# EAGLE design power_supply_stripped_th (EAGLE 7.1.0)
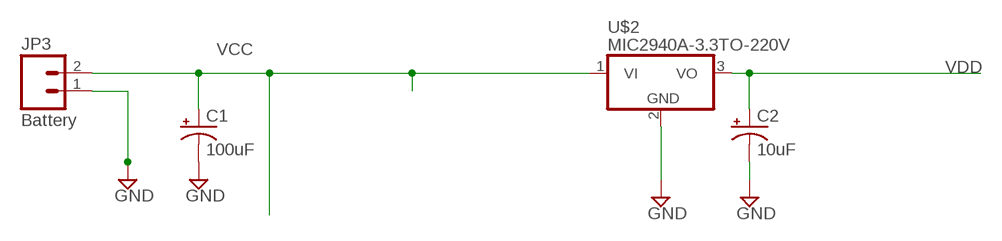
[diagram p0: schematic, sheet 1]

## Parts
C1  100uF  CPOL-USE3.5-8  [E3,5-8]
C2  10uF  CPOL-USE2.5-5  [E2,5-5]
JP3  Battery  M02PTH  [1X02]
U$2  MIC2940A-3.3TO-220V  [TO-220V]

## Nets
GND: C1.- C2.- JP3.1 U$2.2(GND)
VCC: C1.+ JP3.2 U$2.1(VI)
VDD: C2.+ U$2.3(VO)

## Library data of the parts
C1 C2 = rcl:CPOL-US: POLARIZED CAPACITOR, American symbol
JP3 = SparkFun:M02: Header 2 Standard 2-pin 0.1" header. Use with straight break away headers (SKU : PRT-00116), right angle break away headers (PRT-00553), swiss pins (PRT-00743), machine pins (PRT-00117), and female headers (PRT-00115). Molex polarized connector foot print use with SKU : PRT-08233 with associated crimp pins and housings.
U$2 = SparkFun:MIC2940A-3.3: MIC2940A-3.3 Voltage Regulator 3.3V mic2940.pdf

## Board
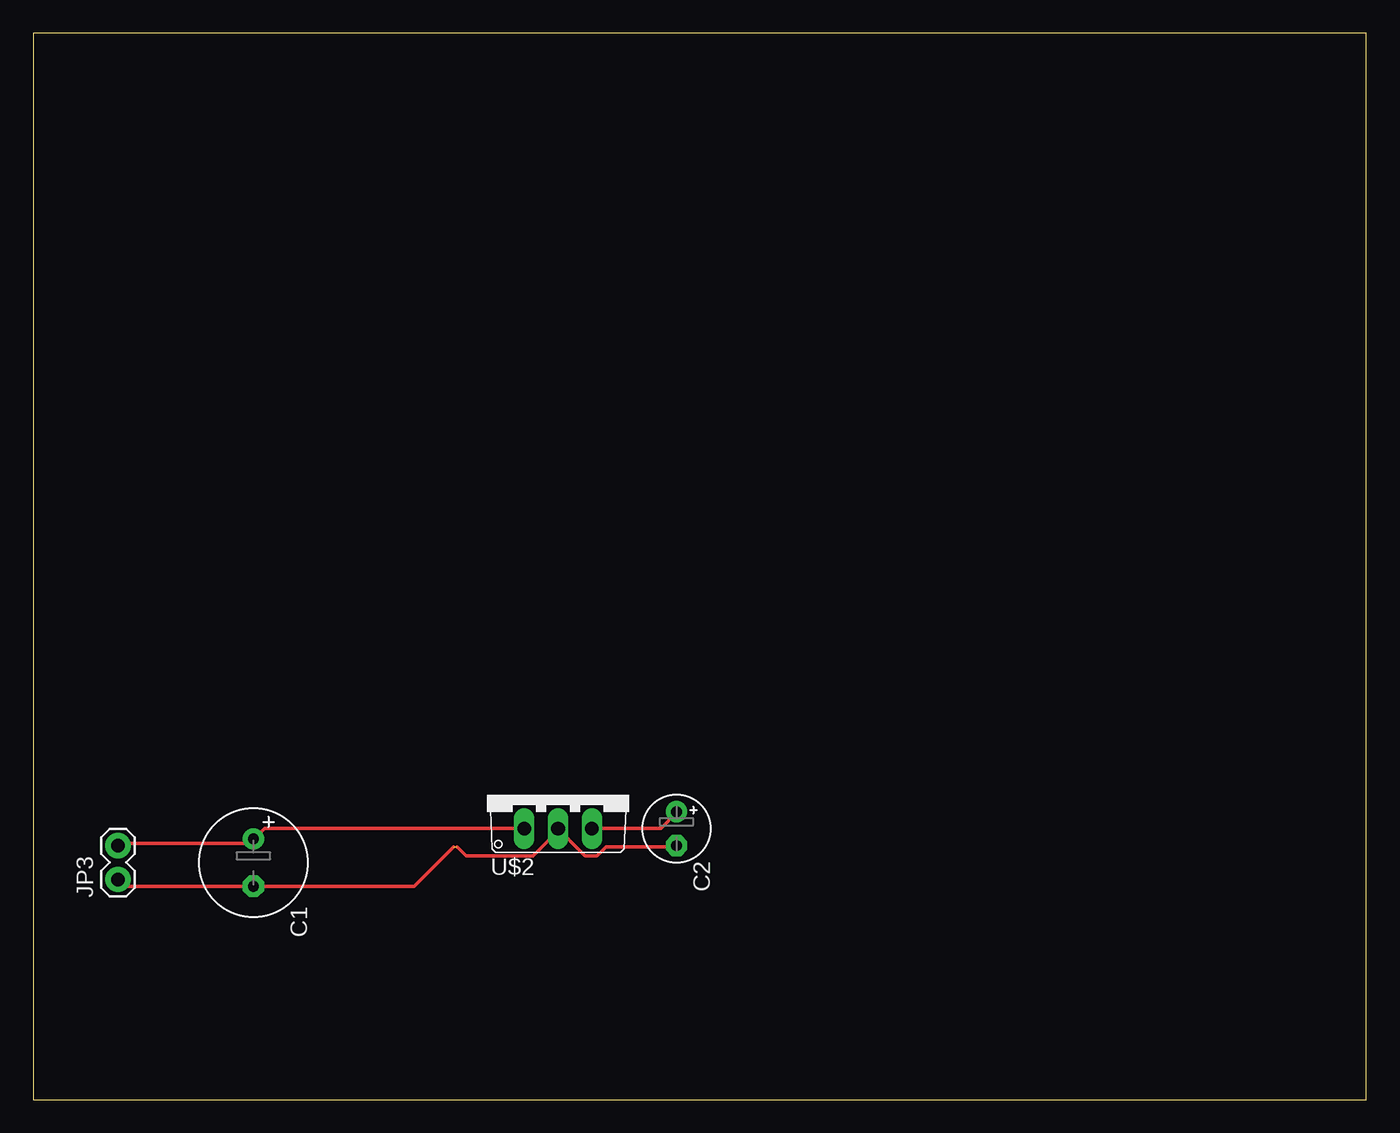
[diagram p1: board, top side]

Size 100 x 80 mm. Coordinates in mm from the lower left corner, seen from the top.
Outline: 0,0 100,0 100,80 0,80 0,0
Copper layers (1*16): Top 0.035mm / dielectric 1.5mm / Bottom 0.035mm
Design rules "default": minimum track width 10mil, minimum drill 24mil, track to track 8mil, track to pad 8mil, pad to pad 8mil, via to via 8mil, smd to smd 8mil, copper to edge 40mil, drill to drill 8mil, minimum pad ring 10mil, minimum via ring 8mil, stop-mask expansion 4mil, vias tented up to drill 0mil, thermal gap 10mil

### Footprints (pad centres in the part's own frame; a part is rotated, then mirrored left to right if it is on the bottom)
E3,5-8 = drill 0.813 pad 1.6: + -1.778,0 | drill 0.813 pad 1.6 octagon: - 1.778,0
E2,5-5 = drill 0.813 pad 1.6: + -1.27,0 | drill 0.813 pad 1.6 octagon: - 1.27,0
1X02 = drill 1.016 pad 1.88: 1 0,0; 2 2.54,0
TO-220V = drill 1.016 long: 1 -1.27,0; 2 1.27,0; 3 3.81,0

### Placement (x,y rotation side)
C1  16.51,17.78 270 top
C2  48.26,20.32 270 top
JP3  6.35,16.51 90 top
U$2  38.1,20.32 0 top

### Tracks (layer width: path | path; a pad name or v marks a point on that pad's centre or on a via)
GND  (1 unrouted)
  Top 0.254: JP3.1 6.86,16 C1.- 28.57,16 31.55,18.97 | 31.77,18.97 32.46,18.29 37.49,18.29 39.32,20.12 U$2.2 39.55,20.12 41.38,18.29 42.29,18.29 42.98,18.97 48.23,18.97 C2.-
VCC
  Top 0.254: U$2.1 36.8,20.34 17.37,20.34 16.69,19.66 C1.+ 16.46,19.43 16.23,19.2 6.4,19.2 JP3.2
VDD
  Top 0.254: U$2.3 42.06,20.34 47.09,20.34 48.23,21.49 C2.+